# Altium schematic sheet MCU.SchDoc
size 420 x 297 mm; Address1: Address1; Address2: Address2; Address3: Address3; Address4: Address4; DocumentNumber: АБВГ.123456.001 Э3; SheetNumber: 1; Scale: 1:1; DocumentType: Схема электрическая принципиальная; FirstReferrence: АБВГ.123456.001
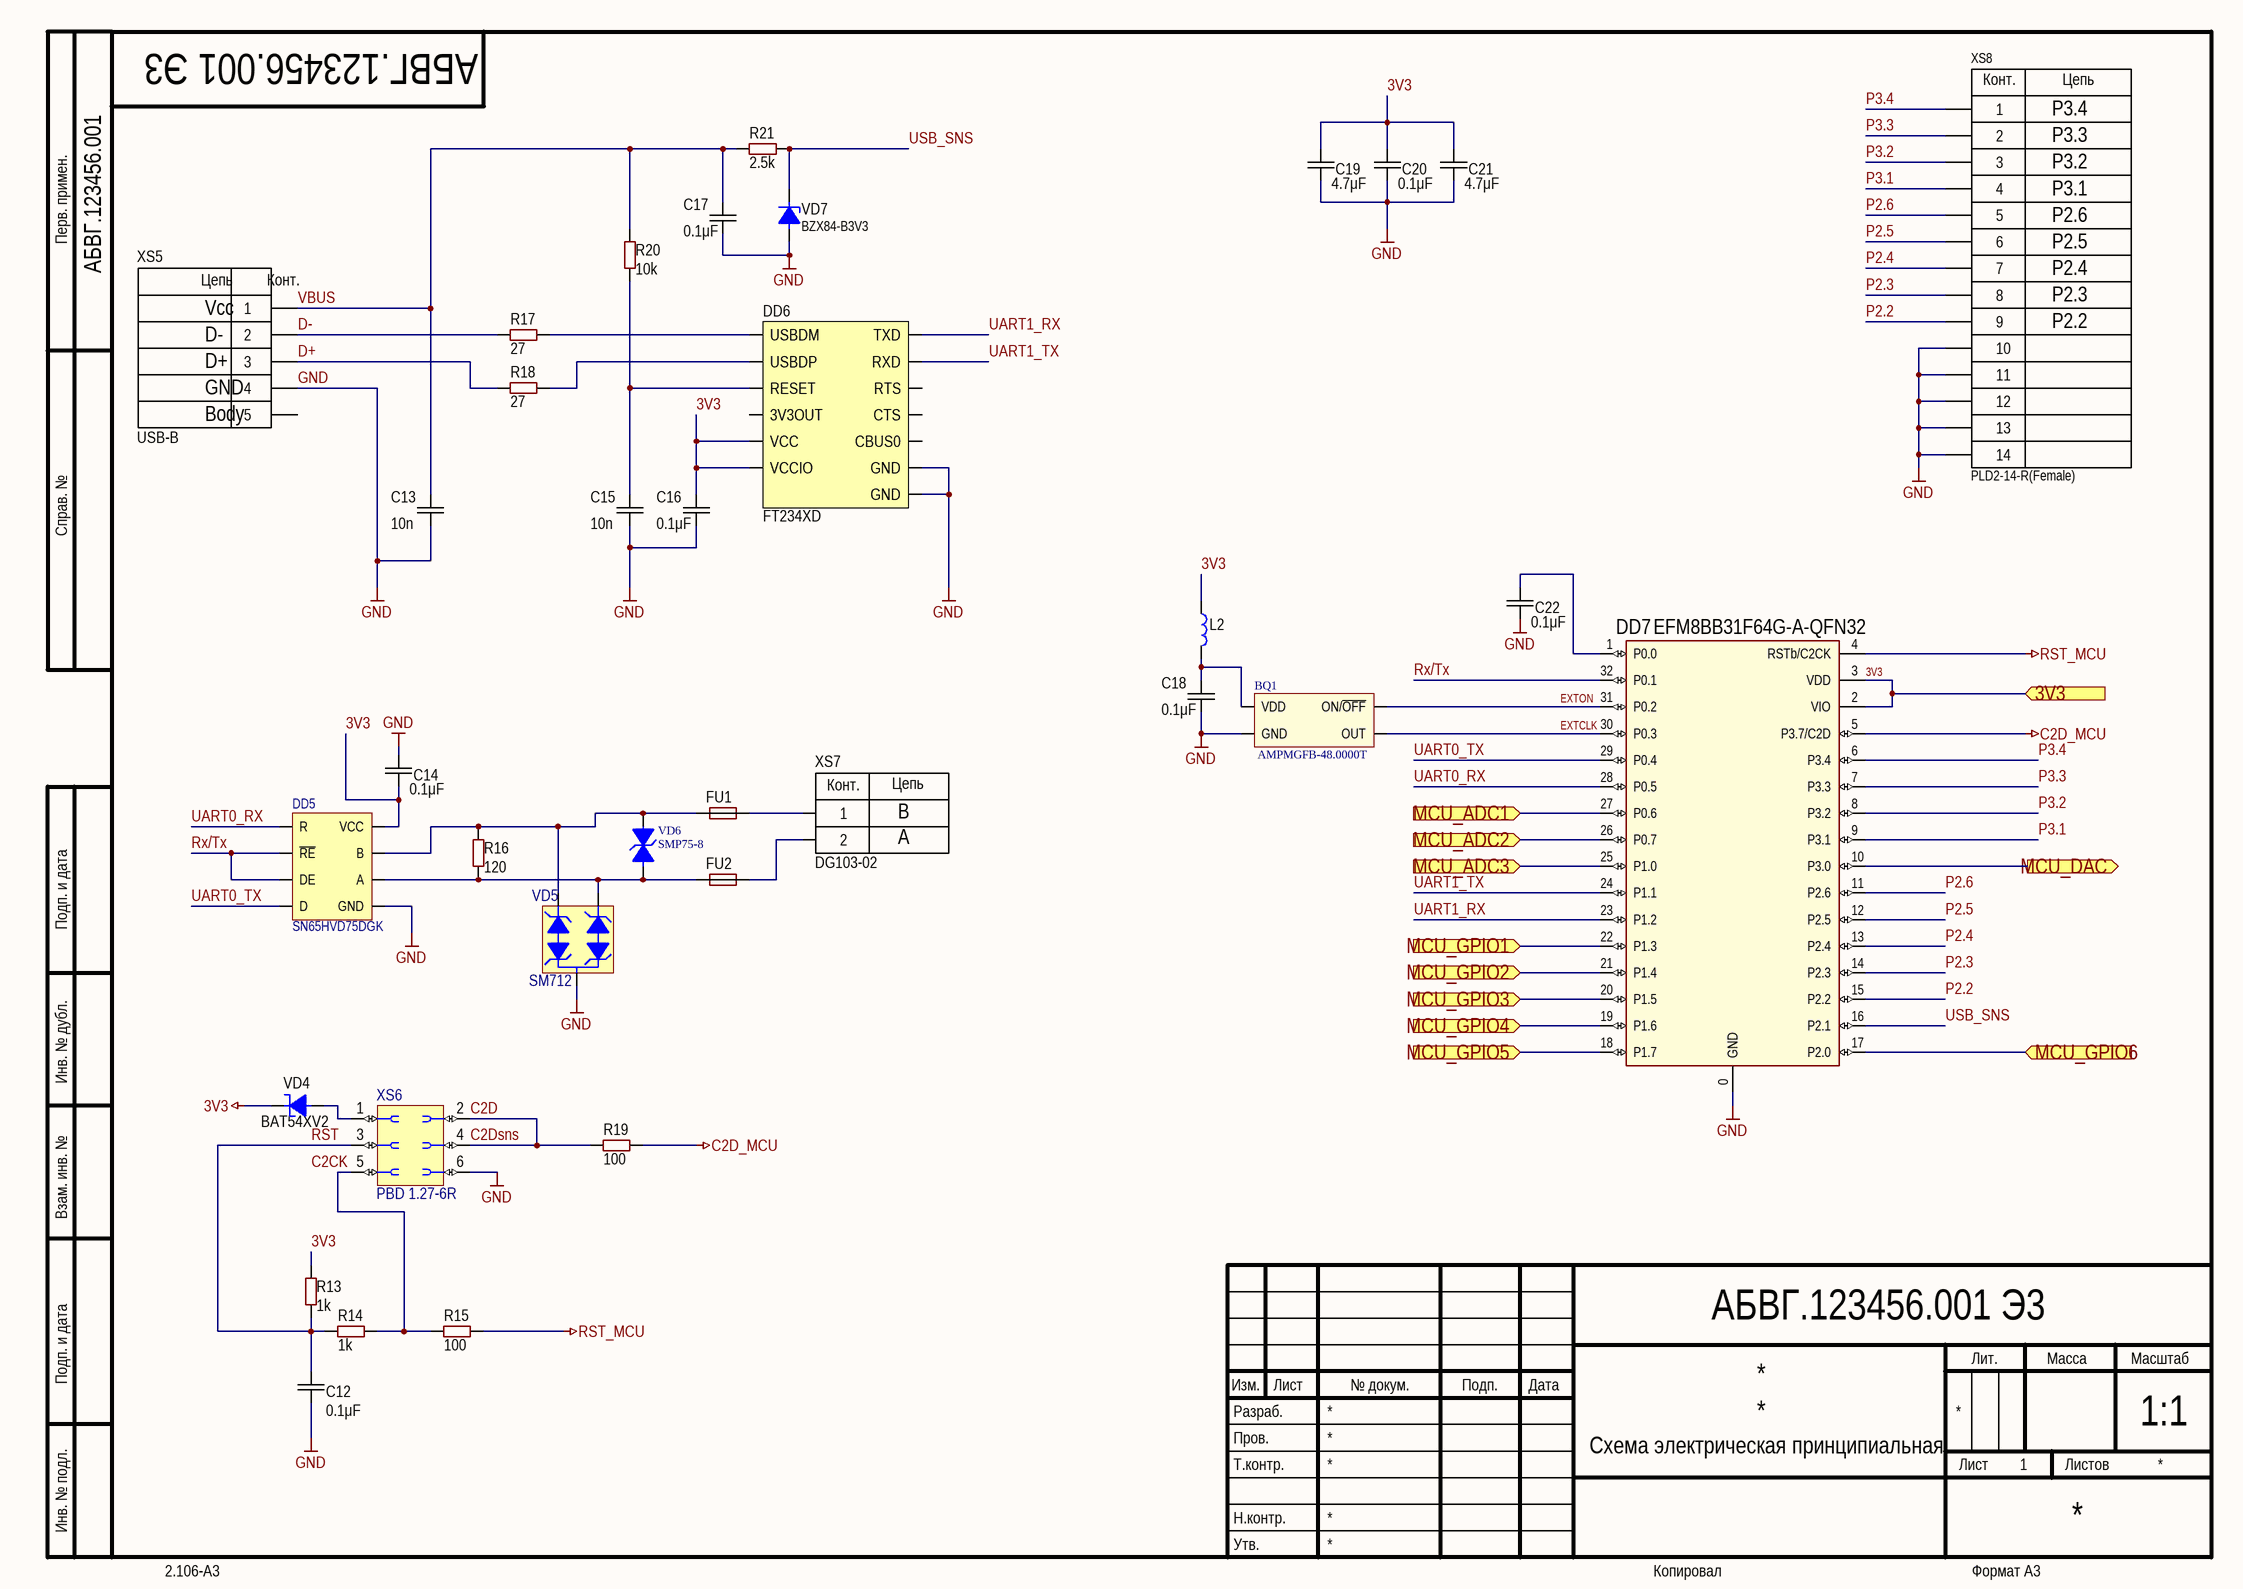
[diagram p0: MCU.SchDoc]

## Parts
BQ1  AMPMGFB-48.0000T  [AMPMGFB(1.6x1.2)]
C12  value 0.1μF  [CAP: 0603]
C13  value 10n  [CAP: 0603]
C14  value 0.1μF  [CAP: 0603]
C15  value 10n  [CAP: 0603]
C16  value 0.1μF  [CAP: 0603]
C17  value 0.1μF  [CAP: 0603]
C18  value 0.1μF  [CAP: 0603]
C19  value 4.7μF  [CAP: 0603]
C20  value 0.1μF  [CAP: 0603]
C21  value 4.7μF  [CAP: 0603]
C22  value 0.1μF  [CAP: 0603]
DD5  SN65HVD75DGK  [VSSOP-8]
DD6  FT234XD  [12-DFN]
DD7  EFM8BB31F64G-A-QFN32  [32-QFN(4x4)]
FU1  (no value)  [FUSE: 0603]
FU2  (no value)  [FUSE: 0603]
L2  BLM18AG102SN1D  [IND: 0603]  (value not drawn)
R13  value 1k  [RES: 0603]
R14  value 1k  [RES: 0603]
R15  value 100  [RES: 0603]
R16  value 120  [RES: 0603]
R17  value 27  [RES: 0603]
R18  value 27  [RES: 0603]
R19  value 100  [RES: 0603]
R20  value 10k  [RES: 0603]
R21  value 2.5k  [RES: 0603]
VD4  PartNumber: BAT54XV2  [DIODE: SOD523]
VD5  SM712  [SOT23]
VD6  SMP75-8  [DIODE: SMB]
VD7  BZX84-B3V3  [SOT23]
XS5  USB-B  [CON: USB-B(Female vertical)]
XS6  PBD 1.27-6R  [CON: PLLD-6R(1.27)]
XS7  DG103-02  [DG103-02]
XS8  PLD2-14-R(Female)  [CON: PLD2-14-R(Female)]

## Ports
3V3 (in), MCU_ADC1 (in), MCU_ADC2 (in), MCU_ADC3 (in), MCU_DAC (out), MCU_GPIO1 (in), MCU_GPIO2 (in), MCU_GPIO3 (in), MCU_GPIO4 (in), MCU_GPIO5 (in), MCU_GPIO6 (in)

## Nets
3V3: C14.1 C16.2 C19.2 C20.2 C21.2 DD5.8(VCC) DD6.4(VCC) DD6.9(VCCIO) DD7.2(VIO) DD7.3(VDD) L2.1 R13.1 VD4.2 ; port 3V3
C2D_MCU: DD7.5(P3.7/C2D) R19.1
GND: BQ1.2(GND) C12.1 C13.1 C14.2 C15.1 C16.1 C17.1 C18.1 C19.1 C20.1 C21.1 C22.1 DD5.5(GND) DD6.5(GND) DD6.13(GND) DD7.0(GND) VD5.3 VD7.1 XS5.4 XS6.6 XS8.10 XS8.11 XS8.12 XS8.13 XS8.14
RST_MCU: DD7.4(RSTb/C2CK) R15.2
C2D: R19.2 XS6.2 XS6.4  [also labelled C2Dsns]
D+: R18.2 XS5.3
D-: R17.2 XS5.2
EXTCLK: BQ1.3(OUT) DD7.30(P0.3)
EXTON: BQ1.1(ON/~{OFF}) DD7.31(P0.2)
MCU_ADC1: DD7.27(P0.6) ; port MCU_ADC1
MCU_ADC2: DD7.26(P0.7) ; port MCU_ADC2
MCU_ADC3: DD7.25(P1.0) ; port MCU_ADC3
MCU_DAC: DD7.10(P3.0) ; port MCU_DAC
MCU_GPIO1: DD7.22(P1.3) ; port MCU_GPIO1
MCU_GPIO2: DD7.21(P1.4) ; port MCU_GPIO2
MCU_GPIO3: DD7.20(P1.5) ; port MCU_GPIO3
MCU_GPIO4: DD7.19(P1.6) ; port MCU_GPIO4
MCU_GPIO5: DD7.18(P1.7) ; port MCU_GPIO5
MCU_GPIO6: DD7.17(P2.0) ; port MCU_GPIO6
P2.2: DD7.15(P2.2) XS8.9
P2.3: DD7.14(P2.3) XS8.8
P2.4: DD7.13(P2.4) XS8.7
P2.5: DD7.12(P2.5) XS8.6
P2.6: DD7.11(P2.6) XS8.5
P3.1: DD7.9(P3.1) XS8.4
P3.2: DD7.8(P3.2) XS8.3
P3.3: DD7.7(P3.3) XS8.2
P3.4: DD7.6(P3.4) XS8.1
RST: C12.2 R13.2 R14.1 XS6.3
Rx/Tx: DD5.2(~{RE}) DD5.3(DE) DD7.32(P0.1)
UART0_RX: DD5.1(R) DD7.28(P0.5)
UART0_TX: DD5.4(D) DD7.29(P0.4)
UART1_RX: DD6.7(TXD) DD7.23(P1.2)
UART1_TX: DD6.10(RXD) DD7.24(P1.1)
USB_SNS: DD7.16(P2.1) R21.1 VD7.2
VBUS: C13.2 C17.2 R20.2 R21.2 XS5.1
NetBQ1_4: BQ1.4(VDD) C18.2 L2.2
NetC15_2: C15.2 DD6.2(RESET) R20.1
NetC22_2: C22.2 DD7.1(P0.0)
NetDD5_6: DD5.6(A) FU2.1 R16.1 VD5.2 VD6.1
NetDD5_7: DD5.7(B) FU1.1 R16.2 VD5.1 VD6.2
NetDD6_1: DD6.1(USBDM) R17.1
NetDD6_12: DD6.12(USBDP) R18.1
NetFU1_2: FU1.2 XS7.1
NetFU2_2: FU2.2 XS7.2
NetR14_2: R14.2 R15.1 XS6.5
NetVD4_1: VD4.1 XS6.1

Not connected (* = marked no-connect by the designer): DD6 3(3V3OUT) 6(CBUS0) 8(RTS) 11(CTS); XS5 5

## Notes on the sheet
- P3.4
- P3.2
- P3.3
- P2.5
- P2.6
- P3.1
- P2.2
- P2.3
- P2.4
- B
- A
- Labels drawn without touching a wire or pin: C2CK
- Перв. примен.
- Справ. №
- Подп. и дата
- Инв. № дубл.
- Взам. инв. №
- Разраб.
- Изм.
- Лист
- № докум.
- Подп.
- Дата
- Лит.
- Масса
- Масштаб
- Пров.
- Т.контр.
- Листов
- Инв. № подл.
- Утв.
- Н.контр.
- 2.106-A3
- Копировал
- Формат А3
- (in symbol DG103-02) Конт.; Цепь
- (in symbol PLD2-14(Female)) Конт.; Цепь
- (in symbol USB-B) Цепь; Конт.; Vcc; D-; D+; GND; Body

## Library data of the parts
C12 C14 C16-C18 C20 C22 = Ceramic_0603: Manufacturer: Yageo; PartNumber: CC0603KRX7R7BB104; ValueManufacturerPartNumber: Ceramic capacitor, 0.1μF, X7R, ±10%, 16V, 0603, -55...+125°C; TypeCapacitor: Ceramic capacitor; Tolerance: ±10%; TypeDielectric: X7R; Voltage: 16V; Package: 0603; HelpURL: https://www.digikey.com/product-detail/en/yageo/CC0603KRX7R7BB104/311-1088-1-ND/302998; Temperature: -55...+125°C
C13 C15 = Ceramic_0603: Manufacturer: Yageo; PartNumber: CC0603KRX7R7BB104; ValueManufacturerPartNumber: Ceramic capacitor, 10n, X7R, ±10%, 16V, 0603, -55...+125°C; TypeCapacitor: Ceramic capacitor; Tolerance: ±10%; TypeDielectric: X7R; Voltage: 16V; Package: 0603; HelpURL: https://www.digikey.com/product-detail/en/yageo/CC0603KRX7R7BB104/311-1088-1-ND/302998; Temperature: -55...+125°C
C19 C21 = Ceramic_0603: Manufacturer: Yageo; PartNumber: CC0603KRX7R7BB104; ValueManufacturerPartNumber: Ceramic capacitor, 4.7μF, X7R, ±10%, 16V, 0603, -55...+125°C; TypeCapacitor: Ceramic capacitor; Tolerance: ±10%; TypeDielectric: X7R; Voltage: 16V; Package: 0603; HelpURL: https://www.digikey.com/product-detail/en/yageo/CC0603KRX7R7BB104/311-1088-1-ND/302998; Temperature: -55...+125°C
DD5 = SN65HVD72DGK: RS-485/422; ComponentLink1Description: Datasheet; ComponentLink1URL: https://www.ti.com/lit/ds/symlink/sn65hvd72.pdf?ts=1607084930164&ref_url=https%253A%252F%252Fwww.ti.com%252Fstore%252Fti%252Fen%252Fp%252Fproduct%252F%253Fp%253DSN65HVD72DRBT
DD6 = FT234XD: USB-UART; ComponentLink1Description: Datasheet; ComponentLink1URL: https://ftdichip.com/wp-content/uploads/2020/08/DS_FT234XD.pdf
DD7 = EFM8BB31F64G-A-QFN32: 8051 MCU Core
FU1 FU2 = Fuse: Manufacturer: Littelfuse; PartNumber: 01110501Z; TypeFuse: Electromechanics relay; VoltageMax: 250VAC; Package: 5x20mm; HelpURL: https://www.digikey.com/products/en?keywords=01110501Z; ValueManufacturerPartNumber: =TypeFuse+', '+VoltageMax+', '+MaxCurrent+', '+Package+', '+Temperature
L2 = BLM18AG102SN1D: 100MHz 1K
R13 R14 = Resistor_0603: Manufacturer: Yageo; PartNumber: RC0603JR-07100RL; ValueManufacturerPartNumber: Resistor film, 1k, ±5%, 0603, 0.1W, -55...+125°C; TypeResistor: Resistor film; Power: 0.1W; Tolerance: ±5%; Package: 0603; HelpURL: https://www.digikey.com/product-detail/en/yageo/RC0603JR-07100RL/311-100GRCT-ND/729644; Temperature: -55...+125°C
R15 R19 = Resistor_0603: Manufacturer: Yageo; PartNumber: RC0603JR-07100RL; ValueManufacturerPartNumber: Resistor film, 100, ±5%, 0603, 0.1W, -55...+125°C; TypeResistor: Resistor film; Power: 0.1W; Tolerance: ±5%; Package: 0603; HelpURL: https://www.digikey.com/product-detail/en/yageo/RC0603JR-07100RL/311-100GRCT-ND/729644; Temperature: -55...+125°C
R16 = Resistor_0603: Manufacturer: Yageo; PartNumber: RC0603JR-07100RL; ValueManufacturerPartNumber: Resistor film, 120, ±5%, 0603, 0.1W, -55...+125°C; TypeResistor: Resistor film; Power: 0.1W; Tolerance: ±5%; Package: 0603; HelpURL: https://www.digikey.com/product-detail/en/yageo/RC0603JR-07100RL/311-100GRCT-ND/729644; Temperature: -55...+125°C
R17 R18 = Resistor_0603: Manufacturer: Yageo; PartNumber: RC0603JR-07100RL; ValueManufacturerPartNumber: Resistor film, 27, ±5%, 0603, 0.1W, -55...+125°C; TypeResistor: Resistor film; Power: 0.1W; Tolerance: ±5%; Package: 0603; HelpURL: https://www.digikey.com/product-detail/en/yageo/RC0603JR-07100RL/311-100GRCT-ND/729644; Temperature: -55...+125°C
R20 = Resistor_0603: Manufacturer: Yageo; PartNumber: RC0603JR-07100RL; ValueManufacturerPartNumber: Resistor film, 10k, ±5%, 0603, 0.1W, -55...+125°C; TypeResistor: Resistor film; Power: 0.1W; Tolerance: ±5%; Package: 0603; HelpURL: https://www.digikey.com/product-detail/en/yageo/RC0603JR-07100RL/311-100GRCT-ND/729644; Temperature: -55...+125°C
R21 = Resistor_0603: Manufacturer: Yageo; PartNumber: RC0603JR-07100RL; ValueManufacturerPartNumber: Resistor film, 2.5k, ±5%, 0603, 0.1W, -55...+125°C; TypeResistor: Resistor film; Power: 0.1W; Tolerance: ±5%; Package: 0603; HelpURL: https://www.digikey.com/product-detail/en/yageo/RC0603JR-07100RL/311-100GRCT-ND/729644; Temperature: -55...+125°C
VD4 = Schottky_single: Manufacturer: Diodes Incorporated; ValueManufacturerPartNumber: Schottky diode, 80V, 500mA, 1V, 15pF, SOD-123, -55...+150°C; TypeDiode: Schottky diode; Voltage: 80V; Current: 500mA; VoltageDrop: 1V; RecoveryTime: 15pF; Package: SOD-123; HelpURL: https://www.digikey.com/product-detail/en/diodes-incorporated/MBR0580S1-7/MBR0580S1-7DICT-ND/5080371; Temperature: -55...+150°C
VD5 = SM712: EIA RS-485 ±7V ±12V
VD6 = SMBJ10CA-TR
XS8 = PLD2-14(Female): ComponentLink1Description: Datasheet; ComponentLink1URL: https://www.compel.ru/item-pdf/1e1366ded138976aeb89dd182fa987b9/ps/kls~kls1-207b.pdf
VD7 = BZX84-B3V3: ComponentLink1Description: Datasheet; ComponentLink1URL: https://www.nexperia.com/products/diodes/automotive-diodes/automotive-zener-diodes/BZX84-B3V3.html
XS5 = USB-B: ComponentLink1Description: Datasheet; ComponentLink1URL: https://www.sparkfun.com/datasheets/Prototyping/USB-B%20Connector.pdf; ComponentLink2Description: Datasheet(vertical); ComponentLink2URL: https://app.adam-tech.com/products/download/data_sheet/195855/usb-b-s-vt-data-sheet.pdf